# Altium schematic sheet GBOX_V2.SchDoc
size A4
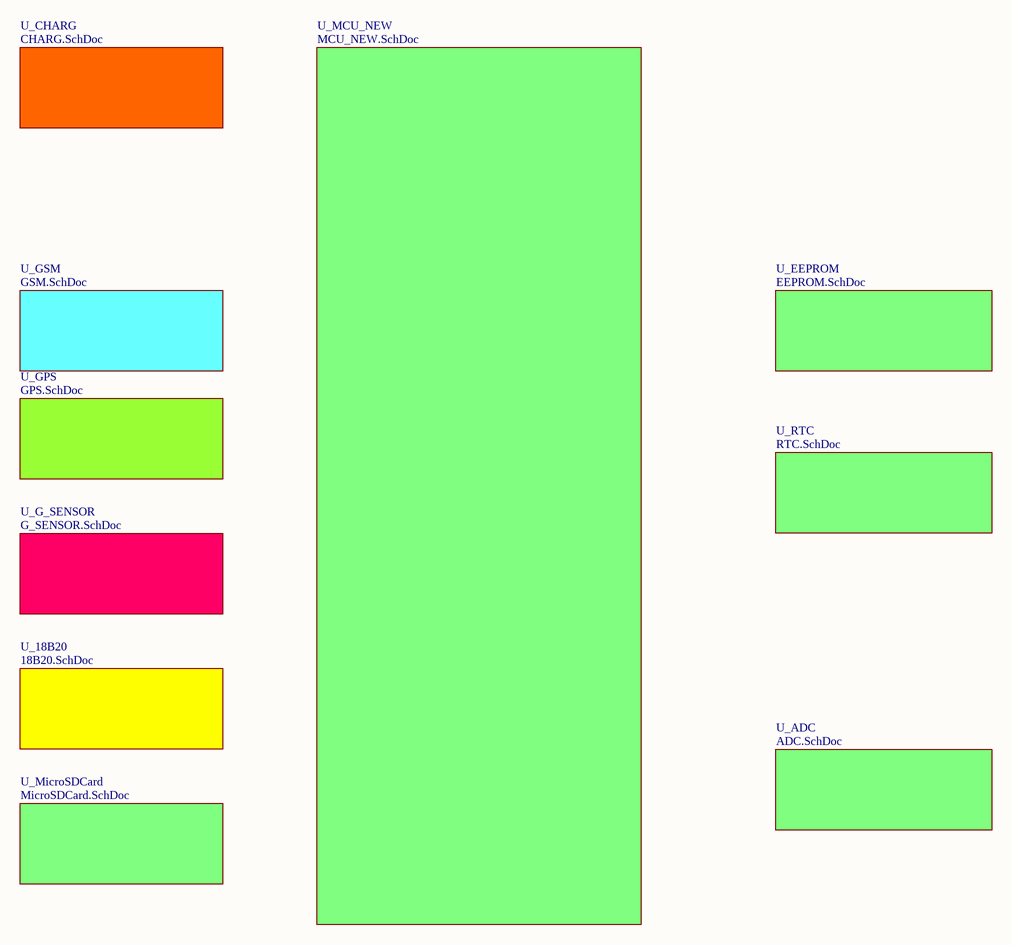
[diagram p0: GBOX_V2.SchDoc]

## Sub-sheets
U_18B20 = 18B20.SchDoc: no entries
U_ADC = ADC.SchDoc: no entries
U_CHARG = CHARG.SchDoc: no entries
U_EEPROM = EEPROM.SchDoc: no entries
U_G_SENSOR = G_SENSOR.SchDoc: no entries
U_GPS = GPS.SchDoc: no entries
U_GSM = GSM.SchDoc: no entries
U_MCU_NEW = MCU_NEW.SchDoc: no entries
U_MicroSDCard = MicroSDCard.SchDoc: no entries
U_RTC = RTC.SchDoc: no entries